# EAGLE design ExpectoPatronum10 (EAGLE 9.5.0)
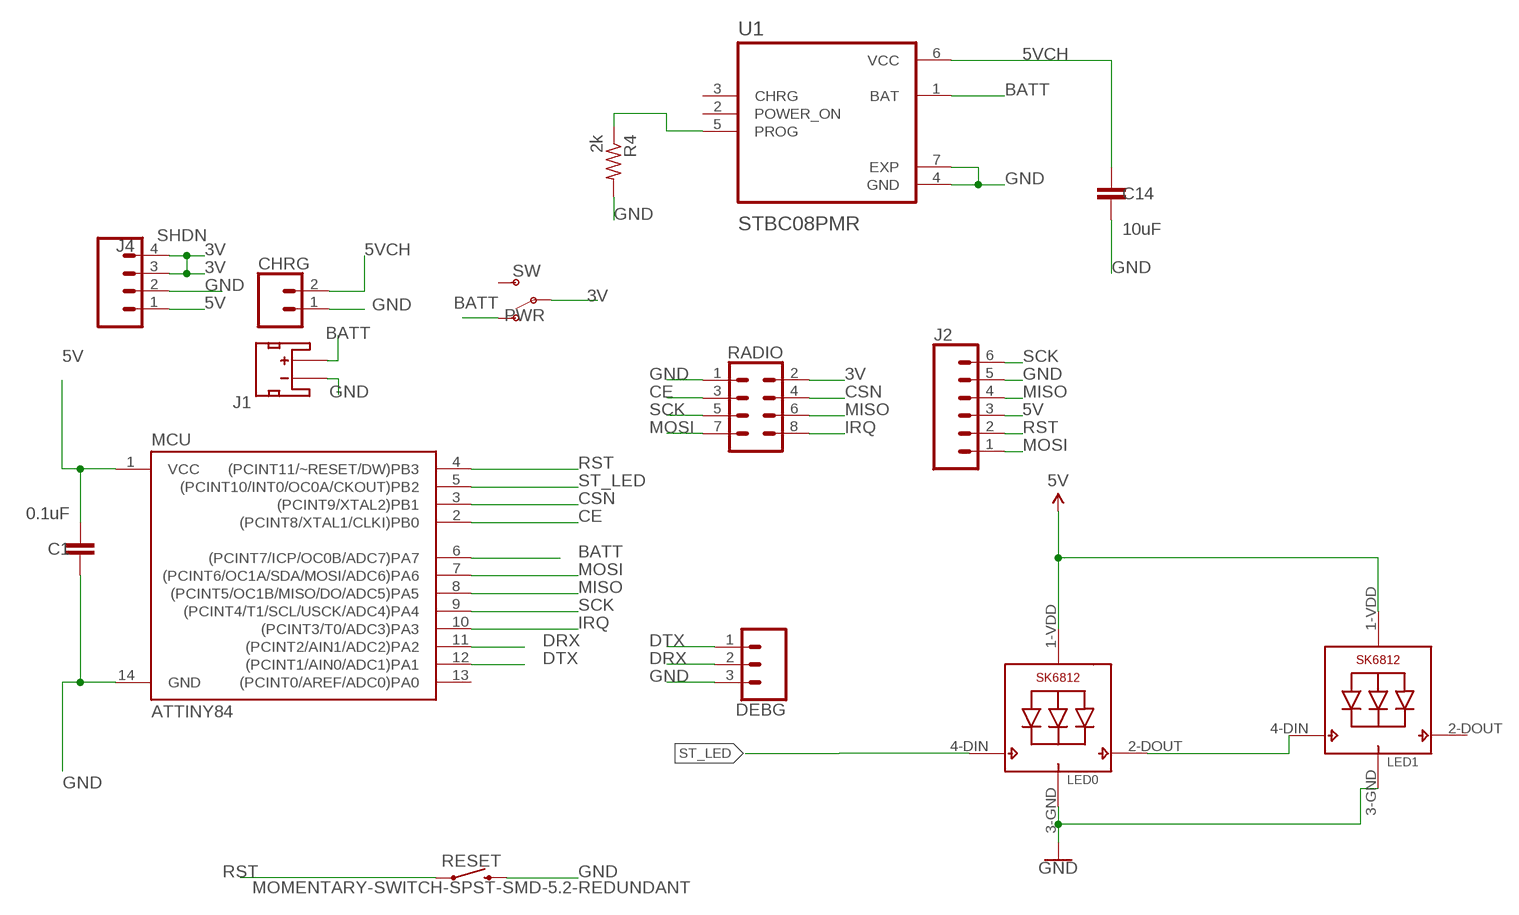
[diagram p0: schematic, sheet 1]

## Parts
C1  0.1uF  0.1UF-0603-25V-5%  [0603]
C14  10uF  10UF-0603-6.3V-20%  [0603]
CHRG  CONN_02  [1X02]
DEBG  CONN_03  [1X03]
J1  JST_2MM_MALE  [JST-2-SMD]
J2  CONN_06NO_SILK_FEMALE_PTH  [1X06_NO_SILK]
J4  CONN_04  [1X04]
LED0  SK6812_5050W  [LED5050_W]
LED1  SK6812_5050W  [LED5050_W]
MCU  ATTINY84  [SO14]
PWR  SW  SWITCH-SPDT-SMD-RIGHT-ANGLE  [SWITCH_SPST_SMD_A]
R4  2k  R-US_R0603  [R0603]
RADIO  CONN_04X2  [2X4]
RESET  MOMENTARY-SWITCH-SPST-SMD-5.2-REDUNDANT  [TACTILE_SWITCH_SMD_5.2MM]
U1  STBC08PMR  [SON95P300X300X100-7N]

## Nets
3V: J4.3 J4.4 PWR.2(P) RADIO.2
5V: C1.2 J2.3 J4.1 LED0.1-VDD(VDD) LED1.1-VDD(VDD) MCU.1(VCC)
5VCH: C14.1 CHRG.2 U1.6(VCC)
BATT: J1.2(+) MCU.6((PCINT7/ICP/OC0B/ADC7)PA7) PWR.1(O) U1.1(BAT)
CE: MCU.2((PCINT8/XTAL1/CLKI)PB0) RADIO.3
CSN: MCU.3((PCINT9/XTAL2)PB1) RADIO.4
DRX: DEBG.2 MCU.11((PCINT2/AIN1/ADC2)PA2)
DTX: DEBG.1 MCU.12((PCINT1/AIN0/ADC1)PA1)
GND: C1.1 C14.2 CHRG.1 DEBG.3 J1.1(-) J2.5 J4.2 LED0.3-GND(GND) LED1.3-GND(GND) MCU.14(GND) R4.2 RADIO.1 RESET.3 RESET.4 U1.4(GND) U1.7(EXP)
IRQ: MCU.10((PCINT3/T0/ADC3)PA3) RADIO.8
MISO: J2.4 MCU.8((PCINT5/OC1B/MISO/DO/ADC5)PA5) RADIO.6
MOSI: J2.1 MCU.7((PCINT6/OC1A/SDA/MOSI/ADC6)PA6) RADIO.7
N$1: R4.1 U1.5(PROG)
N$3: LED0.2-DOUT(DO) LED1.4-DIN(DI)
RST: J2.2 MCU.4((PCINT11/~RESET/DW)PB3) RESET.1 RESET.2
SCK: J2.6 MCU.9((PCINT4/T1/SCL/USCK/ADC4)PA4) RADIO.5
ST_LED: LED0.4-DIN(DI) MCU.5((PCINT10/INT0/OC0A/CKOUT)PB2)
Unconnected: J1.NC1(PAD1) J1.NC2(PAD2) LED1.2-DOUT(DO) MCU.13((PCINT0/AREF/ADC0)PA0) PWR.3(S) U1.2(POWER_ON) U1.3(CHRG)

## Notes on the sheet
- SHDN

## Library data of the parts
C1 = SparkFun-Capacitors:0.1UF: 0.1µF ceramic capacitors A capacitor is a passive two-terminal electrical component used to store electrical energy temporarily in an electric field.; PROD_ID: CAP-08604
C14 = SparkFun-Capacitors:10UF: 10.0µF ceramic capacitors A capacitor is a passive two-terminal electrical component used to store electrical energy temporarily in an electric field.; PROD_ID: CAP-11015
CHRG = SparkFun-Connectors:CONN_02: Multi connection point. Often used as Generic Header-pin footprint for 0.1 inch spaced/style header connections On any of the 0.1 inch spaced packages, you can populate with these: Break Away Headers - Straight <https://www.sparkfun.com/products/116> (PRT-00116) Break Away Male Headers - Right Angle <https://www.sparkfun.com/products/553> (PRT-00553) Female Headers <https://www.sparkfun.com/products/115> (PRT-00115) Break Away Headers - Machine Pin <https://www.sparkfun.com/products/117> (PRT-00117) Break Away Female Headers - Swiss Machine Pin <https://www.sparkfun.com/products/743> (PRT-00743) For SCREWTERMINALS and SPRING TERMINALS visit here: Screw Terimnals on SparkFun.com <https://www.sparkfun.com/search/results?term=Screw+Terminals> (5mm/3.5mm/2.54mm spacing) This device is also useful as a general connection point to wire up your design to another part of your project. Our various solder wires solder well into these plated through hole pads. Hook-Up Wire - Assortment (Stranded, 22 AWG) <https://www.sparkfun.com/products/11375> (PRT-11375) Hook-Up Wire - Assortment (Solid Core, 22 AWG) <https://www.sparkfun.com/products/11367> (PRT-11367) View the entire wire category on our website here <https://www.sparkfun.com/categories/141> Special notes: Molex polarized connector foot print use with: PRT-08233 with associated crimp pins and housings. 2.54_SCREWTERM for use with PRT-10571. 3.5mm Screw Terminal footprints for PRT-08084 5mm Screw Terminal footprints for use with PRT-08432
DEBG = SparkFun-Connectors:CONN_03: Multi connection point. Often used as Generic Header-pin footprint for 0.1 inch spaced/style header connections On any of the 0.1 inch spaced packages, you can populate with these: Break Away Headers - Straight <https://www.sparkfun.com/products/116> (PRT-00116) Break Away Male Headers - Right Angle <https://www.sparkfun.com/products/553> (PRT-00553) Female Headers <https://www.sparkfun.com/products/115> (PRT-00115) Break Away Headers - Machine Pin <https://www.sparkfun.com/products/117> (PRT-00117) Break Away Female Headers - Swiss Machine Pin <https://www.sparkfun.com/products/743> (PRT-00743) Stackable Header - 3 Pin (Female, 0.1") <https://www.sparkfun.com/products/13875> (PRT-13875) For SCREWTERMINALS and SPRING TERMINALS visit here: Screw Terimnals on SparkFun.com <https://www.sparkfun.com/search/results?term=Screw+Terminals> (5mm/3.5mm/2.54mm spacing) This device is also useful as a general connection point to wire up your design to another part of your project. Our various solder wires solder well into these plated through hole pads. Hook-Up Wire - Assortment (Stranded, 22 AWG) <https://www.sparkfun.com/products/11375> (PRT-11375) Hook-Up Wire - Assortment (Solid Core, 22 AWG) <https://www.sparkfun.com/products/11367> (PRT-11367) View the entire wire category on our website here <https://www.sparkfun.com/categories/141> Special notes: Molex polarized connector foot print use with SKU : PRT-08232 with associated crimp pins and housings.
J1 = SparkFun-Connectors:JST_2MM_MALE: JST 2MM MALE RA CONNECTOR Two pin, compact surface mount connector. Commonly used as a battery input connection point. We really like the solid locking feeling and high current rating on these small connectors. We use these all the time as battery connectors. Mates to single-cell LiPo batteries. Here is the connector we sell at SparkFun: JST Right Angle Connector - White <https://www.sparkfun.com/products/8612> (PRT-08612) Datasheet <http://www.sparkfun.com/datasheets/Prototyping/Connectors/JST-Horizontal.pdf> It was used on these SparkFun products: SparkFun MOSFET Power Controller <https://www.sparkfun.com/products/11214> (PRT-11214) SparkFun Battery Babysitter - LiPo Battery Manager <https://www.sparkfun.com/products/13777> (PRT-13777) And many, many others that required a lipo battery connection.; PROD_ID: CONN-11443; SF_ID: PRT-08612
J2 = SparkFun-Connectors:CONN_06: Multi connection point. Often used as Generic Header-pin footprint for 0.1 inch spaced/style header connections On any of the 0.1 inch spaced packages, you can populate with these: Break Away Headers - Straight <https://www.sparkfun.com/products/116> (PRT-00116) Break Away Male Headers - Right Angle <https://www.sparkfun.com/products/553> (PRT-00553) Female Headers <https://www.sparkfun.com/products/115> (PRT-00115) Break Away Headers - Machine Pin <https://www.sparkfun.com/products/117> (PRT-00117) Break Away Female Headers - Swiss Machine Pin <https://www.sparkfun.com/products/743> (PRT-00743) Arduino Stackable Header - 6 Pin <https://www.sparkfun.com/products/9280> (PRT-09280) For SCREWTERMINALS and SPRING TERMINALS visit here: Screw Terimnals on SparkFun.com <https://www.sparkfun.com/search/results?term=Screw+Terminals> (5mm/3.5mm/2.54mm spacing) This device is also useful as a general connection point to wire up your design to another part of your project. Our various solder wires solder well into these plated through hole pads. Hook-Up Wire - Assortment (Stranded, 22 AWG) <https://www.sparkfun.com/products/11375> (PRT-11375) Hook-Up Wire - Assortment (Solid Core, 22 AWG) <https://www.sparkfun.com/products/11367> (PRT-11367) View the entire wire category on our website here <https://www.sparkfun.com/categories/141>; PROD_ID: CONN-08437
J4 = SparkFun-Connectors:CONN_04: Multi connection point. Often used as Generic Header-pin footprint for 0.1 inch spaced/style header connections On any of the 0.1 inch spaced packages, you can populate with these: Break Away Headers - Straight <https://www.sparkfun.com/products/116> (PRT-00116) Break Away Male Headers - Right Angle <https://www.sparkfun.com/products/553> (PRT-00553) Female Headers <https://www.sparkfun.com/products/115> (PRT-00115) Break Away Headers - Machine Pin <https://www.sparkfun.com/products/117> (PRT-00117) Break Away Female Headers - Swiss Machine Pin <https://www.sparkfun.com/products/743> (PRT-00743) For SCREWTERMINALS and SPRING TERMINALS visit here: Screw Terimnals on SparkFun.com <https://www.sparkfun.com/search/results?term=Screw+Terminals> (5mm/3.5mm/2.54mm spacing) This device is also useful as a general connection point to wire up your design to another part of your project. Our various solder wires solder well into these plated through hole pads. Hook-Up Wire - Assortment (Stranded, 22 AWG) <https://www.sparkfun.com/products/11375> (PRT-11375) Hook-Up Wire - Assortment (Solid Core, 22 AWG) <https://www.sparkfun.com/products/11367> (PRT-11367) View the entire wire category on our website here <https://www.sparkfun.com/categories/141> Special notes: Molex polarized connector foot print use with SKU : PRT-08231 with associated crimp pins and housings. 1MM SMD Version SKU: PRT-10208; PROD_ID: CONN-09696
LED0 LED1 = SK6812:SK6812
MCU = SparkFun-IC-Microcontroller:ATTINY84: Atmel 14-pin 2/4/8kB flash uC Datasheet <https://cdn.sparkfun.com/datasheets/Widgets/doc8006.pdf> SparkFun Products Tiny AVR Programmer <https://www.sparkfun.com/products/11801> (PGM-11801) SparkFun Servo Trigger - Continuous Rotation <https://www.sparkfun.com/products/13872> (WIG-13872) SparkFun Servo Trigger <https://www.sparkfun.com/products/13118> (WIG-13118); PROD_ID: IC-11285
PWR = SparkFun-Switches:SWITCH-SPDT: Single Pole, Double Throw (SPDT) Switch Single-pole, double-throw (SPDT) switch. Variant Overview SMD-AYZ0202 Surface Mount DPDT Switch <https://www.sparkfun.com/products/597> (COM-00597) Used on e.g. LilyPad Arduino USB - ATmega32U4 Board <https://www.sparkfun.com/products/12049> PTH-11.6X4.0MM SPDT Mini Power Switch <https://www.sparkfun.com/products/102> (COM-00102) Used on e.g. SparkFun Simon Says - Through-Hole Soldering Kit <https://www.sparkfun.com/products/10547> (KIT-10547) PTH-11.6X4.0MM-KIT KIT version of SPDT Mini Power Switch - Simplifies soldering by removing tStop of switch pins - only one side can be soldered. PTH-11.6X4.0MM-LOCK LOCK version of SPDT Mini Power Switch - Offset pins hold switch in place for easier soldering. SMD-RIGHT-ANGLE Surface Mount Right Angle Switch <https://www.sparkfun.com/products/10860> (COM-10860) Used on e.g. SparkFun ESP8266 Thing <https://www.sparkfun.com/products/13231>; PROD_ID: SWCH-10651; SF_SKU: COM-10860
R4 = rcl:R-US_: RESISTOR, American symbol; SPICEPREFIX: R
RADIO = SparkFun-Connectors:CONN_04X2: Multi connection point. Often used as Generic Header-pin footprint for 0.1 inch spaced/style header connections On any of the 0.1 inch spaced packages, you can populate with these: Break Away Headers - Straight <https://www.sparkfun.com/products/116> (PRT-00116) Break Away Male Headers - Right Angle <https://www.sparkfun.com/products/553> (PRT-00553) Female Headers <https://www.sparkfun.com/products/115> (PRT-00115) Break Away Headers - Machine Pin <https://www.sparkfun.com/products/117> (PRT-00117) Break Away Female Headers - Swiss Machine Pin <https://www.sparkfun.com/products/743> (PRT-00743)
RESET = SparkFun-Switches:MOMENTARY-SWITCH-SPST: Momentary Switch (Pushbutton) - SPST Normally-open (NO) SPST momentary switches (buttons, pushbuttons). Variants PTH-12MM - 12mm square, through-hole Momentary Pushbutton Switch - 12mm Square <https://www.sparkfun.com/products/9190> (COM-09190) PTH-6.0MM, PTH-6.0MM-KIT - 6.0mm square, through-hole Mini Pushbutton Switch <https://www.sparkfun.com/products/97> (COM-00097) KIT package intended for soldering kit's - only one side of pads' copper is exposed. PTH-RIGHT-ANGLE-KIT - Right-angle, through-hole Right Angle Tactile Button <https://www.sparkfun.com/products/10791> - Used on SparkFun BigTime Watch Kit <https://www.sparkfun.com/products/11734> SMD-12MM - 12mm square, surface-mount Tactile Button - SMD (12mm) <https://www.sparkfun.com/products/12993> (COM-12993) Used on SparkFun PicoBoard <https://www.sparkfun.com/products/11888> SMD-4.5MM - 4.5mm Square Trackball Switch Used on SparkFun Blackberry Trackballer Breakout <https://www.sparkfun.com/products/13169> SMD-4.6MMX2.8MM - 4.60mm x 2.80mm, surface mount Used on SparkFun SAMD21 Mini Breakout <https://www.sparkfun.com/products/13664> SMD-5.2MM, SMD-5.2-REDUNDANT - 5.2mm square, surface-mount Mini Pushbutton Switch - SMD <https://www.sparkfun.com/products/8720> (COM-08720) Used on Arduino Pro Mini <https://www.sparkfun.com/products/11114> REDUNDANT package connects both switch circuits together SMD-6.0X3.5MM - 6.0 x 3.5mm, surface mount Momentary Reset Switch SMD <https://www.sparkfun.com/products/8229> (COM-08229) SMD-6.2MM-TALL - 6.2mm square, surface mount Tactile Button - SMD (6mm) <https://www.sparkfun.com/products/12992> Used on SparkFun Digital Sandbox <https://www.sparkfun.com/products/12651> SMD-RIGHT-ANGLE - Right-angle, surface mount Used on SparkFun Block for Intel® Edison - Arduino <https://www.sparkfun.com/products/13036>; PROD_ID: SWCH-08247; SF_SKU: COM-08720
U1 = STBC08PMR:STBC08PMR: STBC08 Series 6.5 V Single Standalone Linear Li-Ion Battery Charger - DFN-6; DESCRIPTION: STBC08 Series 6.5 V Single Standalone Linear Li-Ion Battery Charger - DFN-6; DIGI-KEY_PART_NUMBER: 497-5808-1-ND; DIGI-KEY_PURCHASE_URL: https://www.digikey.com.mx/product-detail/en/stmicroelectronics/STBC08PMR/497-5808-1-ND/1506464?utm_source=snapeda&utm_medium=aggregator&utm_campaign=symbol; MF: STMicroelectronics; MP: STBC08PMR; PACKAGE: DFN-6 STMicroelectronics

## Net classes
0 default: width 0.203 mm

## Board
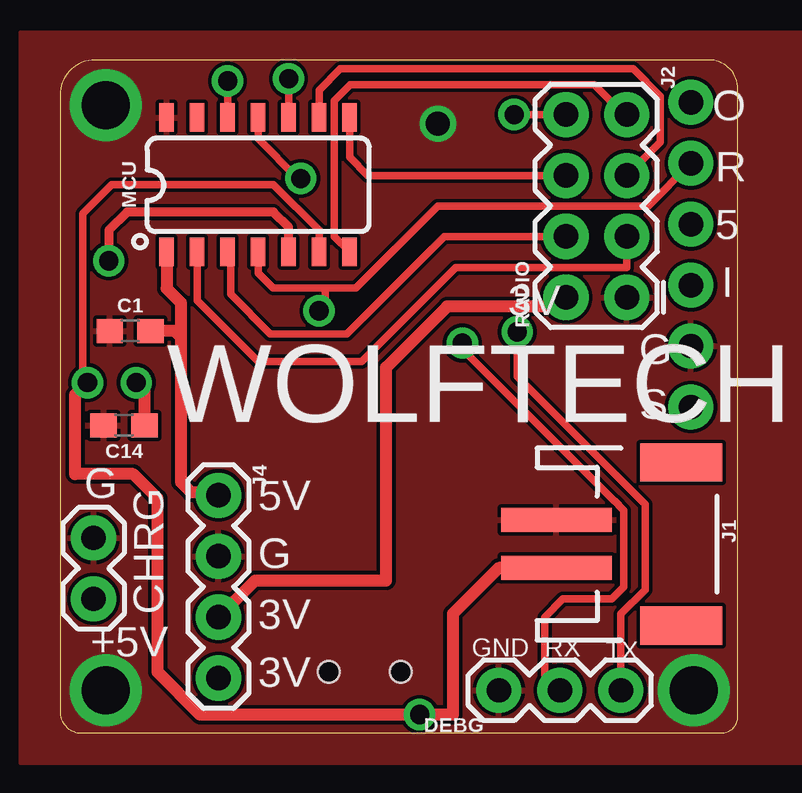
[diagram p1: board, top side]
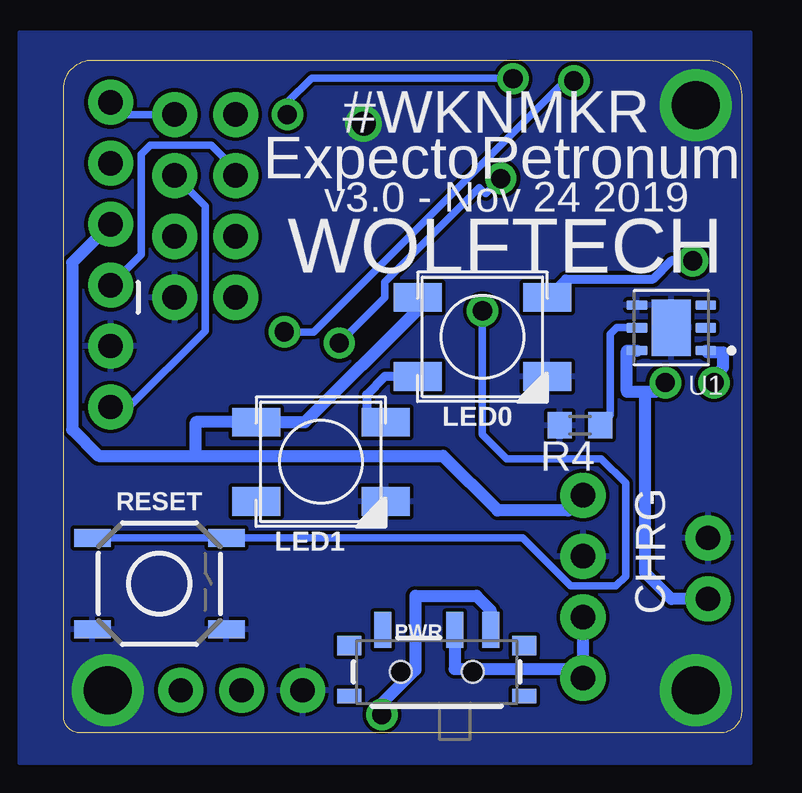
[diagram p2: board, bottom side, seen from below]

Size 28.25 x 28.06 mm. Coordinates in mm from the lower left corner, seen from the top.
Outline: 0,26.59 0,0.89 arc90 0.89,0 27.56,0 arc90 28.25,0.69 28.25,26.85 arc90 27.04,28.06 1.46,28.06 arc90 0,26.59
Copper layers (1*16): Top 0.035mm / dielectric 1.5mm / Bottom 0.035mm
Design rules "OthermillDRC_30_deg_v2": minimum track width 6mil, minimum drill 0.8mm, track to track 6mil, track to pad 6mil, pad to pad 6mil, via to via 6mil, smd to smd 0mil, copper to edge 0mil, drill to drill 6mil, minimum pad ring 10mil, minimum via ring 10mil, stop-mask expansion 1mil, vias tented up to drill 30mil, thermal gap 6mil

### Footprints (pad centres in the part's own frame; a part is rotated, then mirrored left to right if it is on the bottom)
0603 = smd 1.1 x 1: 1 -0.85,0; 2 0.85,0
1X02 = drill 1.016 pad 1.88: 1 0,0; 2 2.54,0
1X03 = drill 1.016 pad 1.88: 1 0,0; 2 2.54,0; 3 5.08,0
JST-2-SMD = smd 1 x 4.6: 1 -1,-3.7; 2 1,-3.7 | smd 1.6 x 3.4: NC1 -3.4,1.5; NC2 3.4,1.5
1X06_NO_SILK = drill 1.016 pad 1.88: 1 0,0; 2 2.54,0; 3 5.08,0; 4 7.62,0; 5 10.16,0; 6 12.7,0
1X04 = drill 1.016 pad 1.88: 1 0,0; 2 2.54,0; 3 5.08,0; 4 7.62,0
LED5050_W = smd 2 x 1.2: 1-VDD 2.7,-1.65; 2-DOUT 2.7,1.65; 3-GND -2.7,1.65; 4-DIN -2.7,-1.65
SO14 = smd 0.6 x 1.2: 1 -3.175,-2.8; 2 -1.905,-2.8; 3 -0.635,-2.8; 4 0.635,-2.8; 5 1.905,-2.8; 6 3.175,-2.8; 7 4.445,-2.8; 8 4.445,2.8; 9 3.175,2.8; 10 1.905,2.8; 11 0.635,2.8; 12 -0.635,2.8; 13 -1.905,2.8; 14 -3.175,2.8
SWITCH_SPST_SMD_A = smd 0.7 x 1.5: 1 -2.25,-1.75; 2 -0.75,-1.75; 3 2.25,-1.75 | smd 1 x 0.6: GND1 -3.65,1; GND3 3.65,1 | smd 1 x 0.8: GND2 -3.65,-1.1; GND4 3.65,-1.1 | hole 0.9: -1.5,0; 1.5,0
R0603 = smd 1 x 1.1: 1 -0.85,0; 2 0.85,0
2X4 = drill 1.016 pad 1.88: 1 -3.81,-1.27; 2 -3.81,1.27; 3 -1.27,-1.27; 4 -1.27,1.27; 5 1.27,-1.27; 6 1.27,1.27; 7 3.81,-1.27; 8 3.81,1.27
TACTILE_SWITCH_SMD_5.2MM = smd 1.524 x 0.762: 1 -2.794,1.905; 2 2.794,1.905; 3 -2.794,-1.905; 4 2.794,-1.905
SON95P300X300X100-7N = smd 0.86 x 0.4: 1 -1.435,0.95; 2 -1.435,0; 3 -1.435,-0.95; 4 1.435,-0.95; 5 1.435,0; 6 1.435,0.95 | smd 1.625 x 2.365: 7 0,0

### Placement (x,y rotation side)
C1  2.92,16.76 0 top
C14  2.67,12.83 180 top
CHRG  1.4,8.13 270 top
DEBG  23.37,1.78 180 top
J1  24.38,7.87 270 top
J2  26.29,26.29 270 top
J4  6.6,9.91 270 top
LED0  10.79,16.51 180 bottom
LED1  17.53,11.3 180 bottom
MCU  7.62,22.86 0 top
PWR  12.7,2.54 180 bottom
R4  6.73,12.83 180 bottom
RADIO  22.35,21.97 90 top
RESET  24.26,6.22 0 bottom
U1  2.92,16.89 180 bottom

### Tracks (layer width: path | path; a pad name or v marks a point on that pad's centre or on a via)
3V
  Top 0.508: RADIO.2 20.7,17.78 16.13,17.78 13.59,15.24 13.59,6.35 8.13,6.35 J4.3
  Bottom 0.508: J4.3 J4.4 6.98,2.67 11.95,2.67 PWR.2
5V
  Top 0.508: J4.1 6.48,10.03 5.46,10.03 5.04,10.45 5.04,16.51 | MCU.1 4.45,18.54 5.04,17.94 5.04,16.51 | 5.04,16.51 4.79,16.76 C1.2
  Bottom 0.508: LED0.1-VDD 13.49,17.65 18.19,12.95 LED1.1-VDD 22.73,12.95 22.73,11.56 | J4.1 7.24,9.27 10.16,9.27 12.45,11.56 22.73,11.56 | J2.3 27.89,19.61 27.89,12.65 26.8,11.56 22.73,11.56
5VCH  (via drill 0.8)
  Top 0.508: v3.17,14.61 3.52,14.26 C14.1
  Bottom 0.508: CHRG.2 2.92,5.59 4.01,6.68 4.01,14.22 | 4.01,14.22 4.78,14.22 4.78,15.94 U1.6 | v3.17,14.61 3.56,14.22 4.01,14.22
BATT  (via drill 0.8)
  Top 0.305: MCU.6 10.79,20.96 8.89,22.86 2.16,22.86 0.95,21.65 0.95,14.8 v1.14,14.61
  Top 0.508: J1.2 18.27,6.87 16.37,4.97 16.37,0.76 v14.99,0.76 5.84,0.76 4.06,2.54 4.06,9.78 3.05,10.79 0.63,10.79 0.63,14.1 v1.14,14.61
  Bottom 0.508: PWR.1 10.45,5.12 11.05,5.71 13.59,5.71 13.59,2.62 14.99,1.22 v14.99,0.76 | v1.14,14.61 1.14,14.86 0.76,15.24 0.76,15.88 1.42,15.88 U1.1
CE
  Top 0.305: MCU.2 5.71,18.03 8.25,15.49 12.57,15.49 16.48,19.41 23.62,19.41 RADIO.3
CSN
  Top 0.305: MCU.3 7.11,19.93 7.11,18.29 8.76,16.64 11.94,16.64 16,20.7 RADIO.4
DRX  (via drill 0.8)
  Top 0.305: v16.76,16.26 16.76,16 23.09,9.68 23.11,9.68 23.29,9.5 23.29,9.48 23.49,9.27 23.49,6.1 22.99,5.59 20.95,5.59 20.19,4.83 20.19,2.41 DEBG.2 | v10.03,23.11 9.91,23.11 8.25,24.77 MCU.11
  Bottom 0.305: v16.76,16.26 14.86,18.16 14.86,18.8 10.92,22.73 10.67,22.48 v10.03,23.11
DTX  (via drill 0.8)
  Top 0.305: DEBG.1 23.37,4.95 24.38,5.97 24.38,9.53 19.05,14.86 v19.05,16.72 | v6.98,27.18 MCU.12
  Bottom 0.305: v19.05,16.72 17.82,16.72 7.37,27.18 v6.98,27.18
GND  (via drill 1, 2)
  other vias: 15.75,25.4 26.42,1.78 1.9,1.78 1.9,26.16
  pour Top: -1.65,29.21 31.37,29.21 31.37,-1.27 -1.65,-1.27
  pour Bottom: -0.38,29.21 30.1,29.21 30.1,-1.27 -0.38,-1.27
IRQ  (via drill 0.8)
  Top 0.305: RADIO.8 v18.92,25.78 | v9.53,27.28 MCU.10
  Bottom 0.305: v18.92,25.78 18.92,26.29 17.91,27.3 9.55,27.3 v9.53,27.28
MISO
  Top 0.305: RADIO.6 12.83,23.24 12.06,24 MCU.8
  Bottom 0.305: J2.4 25.02,19.94 25.02,24.13 24.64,24.51 22.1,24.51 21.08,23.5 RADIO.6
MOSI
  Top 0.305: RADIO.7 23.49,25.78 22.25,27.03 12.1,27.03 11.43,26.36 11.43,20.7 MCU.7
  Bottom 0.305: RADIO.7 25.78,25.78 J2.1
N$1
  Bottom 0.305: U1.5 5.21,16.89 5.46,16.64 5.46,13.25 R4.1
N$3
  Bottom 0.381: LED0.2-DOUT 14.86,14.86 15.62,14.1 15.62,12.95 LED1.4-DIN
RST  (via drill 0.8)
  Top 0.305: 11.05,18.54 12.32,18.54 15.75,21.97 24.51,21.97 J2.2 | 11.05,18.54 8.89,18.54 8.25,19.18 MCU.4 | 11.05,18.54 11.05,17.78 10.79,17.53 v10.79,17.6
  Bottom 0.305: RESET.1 RESET.2 9.13,8.13 7.12,6.12 5.23,6.12 4.83,6.53 4.83,10.41 5.84,11.43 9.78,11.43 10.79,12.45 v10.79,17.6
SCK
  Top 0.305: MCU.9 10.79,26.8 11.68,27.69 23.88,27.69 25.02,26.54 25.02,24.64 RADIO.5
  Bottom 0.305: RADIO.5 22.35,21.97 22.35,16.76 25.53,13.59 J2.6
ST_LED  (via drill 0.8)
  Top 0.381: MCU.5 9.53,21.08 8.89,21.72 2.79,21.72 2.03,20.96 v2.03,19.68
  Bottom 0.381: v2.03,19.68 2.92,19.68 3.68,18.92 7.33,18.92 LED0.4-DIN

### Text on the board
tNames: O | R | 5 | 3V | I | G | WOLFTECH | S | G | 5V | G | CHRG | 3V | +5V | GND | RX | TX | 3V
bNames: #WKNMKR | ExpectoPetronum | v3.0 - Nov 24 2019 | WOLFTECH | CHRG